# EAGLE design shiftLights (EAGLE 9.6.2)
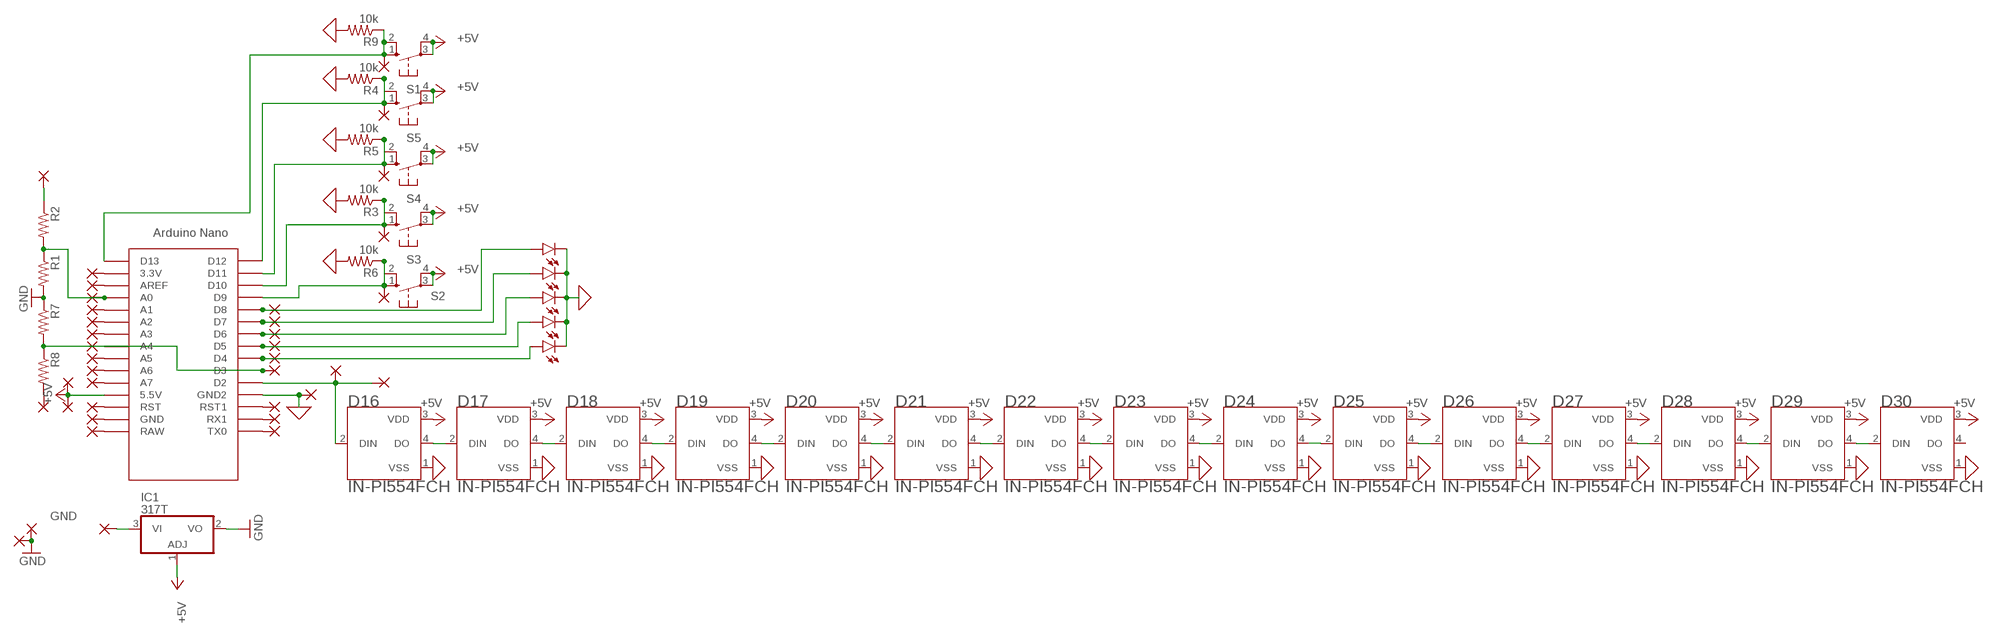
[diagram p0: schematic, sheet 1]

## Parts
5V  1,6/0,9  [1,6/0,9]
+12V  1,6/0,9  [1,6/0,9]
D16  IN-PI554FCH  [LED_IN-PI554FCH]
D17  IN-PI554FCH  [LED_IN-PI554FCH]
D18  IN-PI554FCH  [LED_IN-PI554FCH]
D19  IN-PI554FCH  [LED_IN-PI554FCH]
D20  IN-PI554FCH  [LED_IN-PI554FCH]
D21  IN-PI554FCH  [LED_IN-PI554FCH]
D22  IN-PI554FCH  [LED_IN-PI554FCH]
D23  IN-PI554FCH  [LED_IN-PI554FCH]
D24  IN-PI554FCH  [LED_IN-PI554FCH]
D25  IN-PI554FCH  [LED_IN-PI554FCH]
D26  IN-PI554FCH  [LED_IN-PI554FCH]
D27  IN-PI554FCH  [LED_IN-PI554FCH]
D28  IN-PI554FCH  [LED_IN-PI554FCH]
D29  IN-PI554FCH  [LED_IN-PI554FCH]
D30  IN-PI554FCH  [LED_IN-PI554FCH]
DIM  1,6/0,9  [1,6/0,9]
DIN  1,6/0,9  [1,6/0,9]
GND  1,6/0,9  [1,6/0,9]
GND4  GND  1,6/0,9  [1,6/0,9]
IC1  317T  [TO220H]
LED1  LED5MM  [LED5MM]
LED2  LED5MM  [LED5MM]
LED3  LED5MM  [LED5MM]
LED4  LED5MM  [LED5MM]
LED5  LED5MM  [LED5MM]
PAD1  1,6/0,9  [1,6/0,9]
PAD2  1,6/0,9  [1,6/0,9]
PAD3  1,6/0,9  [1,6/0,9]
PAD4  1,6/0,9  [1,6/0,9]
PAD5  1,6/0,9  [1,6/0,9]
PAD6  1,6/0,9  [1,6/0,9]
PAD7  1,6/0,9  [1,6/0,9]
PAD8  1,6/0,9  [1,6/0,9]
PAD9  1,6/0,9  [1,6/0,9]
PAD10  1,6/0,9  [1,6/0,9]
PAD11  1,6/0,9  [1,6/0,9]
PAD12  1,6/0,9  [1,6/0,9]
PAD13  1,6/0,9  [1,6/0,9]
PAD14  1,6/0,9  [1,6/0,9]
PAD15  1,6/0,9  [1,6/0,9]
PAD16  1,6/0,9  [1,6/0,9]
PAD17  1,6/0,9  [1,6/0,9]
PAD18  1,6/0,9  [1,6/0,9]
PAD19  1,6/0,9  [1,6/0,9]
PAD20  1,6/0,9  [1,6/0,9]
PAD21  1,6/0,9  [1,6/0,9]
PAD22  1,6/0,9  [1,6/0,9]
PAD23  1,6/0,9  [1,6/0,9]
PAD24  1,6/0,9  [1,6/0,9]
PAD25  1,6/0,9  [1,6/0,9]
PAD26  1,6/0,9  [1,6/0,9]
PAD27  1,6/0,9  [1,6/0,9]
PAD28  1,6/0,9  [1,6/0,9]
PAD29  1,6/0,9  [1,6/0,9]
PAD30  1,6/0,9  [1,6/0,9]
R1  R-US_0411/3V  [0411V]
R2  R-US_0411/3V  [0411V]
R3  10k  R-US_0411/3V  [0411V]
R4  10k  R-US_0411/3V  [0411V]
R5  10k  R-US_0411/3V  [0411V]
R6  10k  R-US_0411/3V  [0411V]
R7  R-US_0411/3V  [0411V]
R8  R-US_0411/3V  [0411V]
R9  10k  R-US_0411/3V  [0411V]
RPM  1,6/0,9  [1,6/0,9]
S1  10-XX  [B3F-10XX]
S2  10-XX  [B3F-10XX]
S3  10-XX  [B3F-10XX]
S4  10-XX  [B3F-10XX]
S5  10-XX  [B3F-10XX]
U$1  NANO  [NANO]

## Nets
0: D16.1(VSS) D17.1(VSS) D18.1(VSS) D19.1(VSS) D20.1(VSS) D21.1(VSS) D22.1(VSS) D23.1(VSS) D24.1(VSS) D25.1(VSS) D26.1(VSS) D27.1(VSS) D28.1(VSS) D29.1(VSS) D30.1(VSS) LED1.K(C) LED2.K(C) LED3.K(C) LED4.K(C) LED5.K(C) PAD28.1(P) R3.2 R4.2 R5.2 R6.2 R9.2 U$1.GND1(GND2) ; supply symbol labelled GND
+5V: 5V.1(P) D16.3(VDD) D17.3(VDD) D18.3(VDD) D19.3(VDD) D20.3(VDD) D21.3(VDD) D22.3(VDD) D23.3(VDD) D24.3(VDD) D25.3(VDD) D26.3(VDD) D27.3(VDD) D28.3(VDD) D29.3(VDD) D30.3(VDD) IC1.1(ADJ) PAD23.1(P) S1.3(P) S1.4(P1) S2.3(P) S2.4(P1) S3.3(P) S3.4(P1) S4.3(P) S4.4(P1) S5.3(P) S5.4(P1) U$1.5V(5.5V)
GND: GND4.1(P) GND.1(P) IC1.2(VO) R1.2 R7.1
N$9: DIM.1(P) R2.1
N$15: R8.2 RPM.1(P)
N$16: D16.4(DO) D17.2(DIN)
N$17: D17.4(DO) D18.2(DIN)
N$18: D16.2(DIN) DIN.1(P) PAD29.1(P) U$1.D2
N$20: PAD30.1(P) R7.2 R8.1 U$1.D3
N$21: PAD1.1(P) U$1.A1
N$22: PAD3.1(P) U$1.AREF
N$23: LED1.A PAD4.1(P) U$1.D8
N$24: PAD5.1(P) U$1.3.3V
N$25: LED3.A PAD6.1(P) U$1.D6
N$26: LED4.A PAD7.1(P) U$1.D5
N$27: LED5.A PAD8.1(P) U$1.D4
N$28: PAD9.1(P) U$1.RST1
N$29: PAD10.1(P) U$1.RX1
N$30: PAD11.1(P) U$1.TX0
N$31: PAD2.1(P) R1.1 R2.2 U$1.A0
N$32: PAD13.1(P) R6.1 S2.1(S) S2.2(S1) U$1.D9
N$33: PAD12.1(P) R3.1 S3.1(S) S3.2(S1) U$1.D10
N$34: PAD15.1(P) R5.1 S4.1(S) S4.2(S1) U$1.D11
N$35: D18.4(DO) D19.2(DIN)
N$36: PAD17.1(P) U$1.A2
N$37: PAD18.1(P) U$1.A3
N$38: PAD19.1(P) U$1.A4
N$39: PAD20.1(P) U$1.A5
N$40: PAD21.1(P) U$1.A6
N$41: PAD22.1(P) U$1.A7
N$42: +12V.1(P) IC1.3(VI)
N$43: PAD24.1(P) U$1.RST
N$44: PAD25.1(P) U$1.GND
N$45: PAD26.1(P) U$1.RAW
N$46: LED2.A PAD27.1(P) U$1.D7
N$47: D19.4(DO) D20.2(DIN)
N$48: PAD16.1(P) R4.1 S5.1(S) S5.2(S1) U$1.D12
N$49: D20.4(DO) D21.2(DIN)
N$50: D21.4(DO) D22.2(DIN)
N$51: D22.4(DO) D23.2(DIN)
N$52: PAD14.1(P) R9.1 S1.1(S) S1.2(S1) U$1.D13
N$53: D23.4(DO) D24.2(DIN)
N$54: D24.4(DO) D25.2(DIN)
N$55: D25.4(DO) D26.2(DIN)
N$56: D26.4(DO) D27.2(DIN)
N$57: D27.4(DO) D28.2(DIN)
N$58: D28.4(DO) D29.2(DIN)
N$59: D29.4(DO) D30.2(DIN)
Unconnected: D30.4(DO) U$1.ICSP1 U$1.ICSP2 U$1.ICSP3 U$1.ICSP4 U$1.ICSP5 U$1.ICSP6

## Library data of the parts
5V +12V DIM DIN GND GND4 PAD1-PAD30 RPM = wirepad:1,6/0,9: THROUGH-HOLE PAD
D16-D30 = IN-PI554FCH:IN-PI554FCH: 5050RGB with integrated IC built in 4 PIN Viewing angle: 120 degrees Check availability <https://pricing.snapeda.com/parts/IN-PI554FCH/Inolux/view-part?ref=eda>; AVAILABILITY: In Stock; DESCRIPTION: Addressable Lighting IN-PI554FCH 1 LED Discrete PWM Red, Green, Blue (RGB) 5.00mm L x 5.00mm W; MF: Inolux; MP: IN-PI554FCH; PACKAGE: Inolux; PRICE: None; PURCHASE-URL: https://pricing.snapeda.com/search/part/IN-PI554FCH/?ref=eda
IC1 = linear:*317: Positive VOLTAGE REGULATOR
LED1-LED5 = led:LED: LED OSRAM: - CHIPLED LG R971, LG N971, LY N971, LG Q971, LY Q971, LO R971, LY R971 LH N974, LH R974 LS Q976, LO Q976, LY Q976 LO Q996 - Hyper CHIPLED LW Q18S LB Q993, LB Q99A, LB R99A - SideLED LS A670, LO A670, LY A670, LG A670, LP A670 LB A673, LV A673, LT A673, LW A673 LH A674 LY A675 LS A676, LA A676, LO A676, LY A676, LW A676 LS A679, LY A679, LG A679 - Hyper Micro SIDELED® LS Y876, LA Y876, LO Y876, LY Y876 LT Y87S - SmartLED LW L88C, LW L88S LB L89C, LB L89S, LG L890 LS L89K, LO L89K, LY L89K LS L896, LA L896, LO L896, LY L896 - TOPLED LS T670, LO T670, LY T670, LG T670, LP T670 LSG T670, LSP T670, LSY T670, LOP T670, LYG T670 LG T671, LOG T671, LSG T671 LB T673, LV T673, LT T673, LW T673 LH T674 LS T676, LA T676, LO T676, LY T676, LB T676, LH T676, LSB T676, LW T676 LB T67C, LV T67C, LT T67C, LS T67K, LO T67K, LY T67K, LW E67C LS E67B, LA E67B, LO E67B, LY E67B, LB E67C, LV E67C, LT E67C LW T67C LS T679, LY T679, LG T679 LS T770, LO T770, LY T770, LG T770, LP T770 LB T773, LV T773, LT T773, LW T773 LH T774 LS E675, LA E675, LY E675, LS T675 LS T776, LA T776, LO T776, LY T776, LB T776 LHGB T686 LT T68C, LB T68C - Hyper Mini TOPLED® LB M676 - Mini TOPLED Santana® LG M470 LS M47K, LO M47K, LY M47K Source: http://www.osram.convergy.de LUXEON: - LUMILED® LXK2-PW12-R00, LXK2-PW12-S00, LXK2-PW14-U00, LXK2-PW14-V00 LXK2-PM12-R00, LXK2-PM12-S00, LXK2-PM14-U00 LXK2-PE12-Q00, LXK2-PE12-R00, LXK2-PE12-S00, LXK2-PE14-T00, LXK2-PE14-U00 LXK2-PB12-K00, LXK2-PB12-L00, LXK2-PB12-M00, LXK2-PB14-N00, LXK2-PB14-P00, LXK2-PB14-Q00 LXK2-PR12-L00, LXK2-PR12-M00, LXK2-PR14-Q00, LXK2-PR14-R00 LXK2-PD12-Q00, LXK2-PD12-R00, LXK2-PD12-S00 LXK2-PH12-R00, LXK2-PH12-S00 LXK2-PL12-P00, LXK2-PL12-Q00, LXK2-PL12-R00 Source: www.luxeon.com KINGBRIGHT: KA-3528ASYC Source: www.kingbright.com
R1-R9 = rcl:R-US_: RESISTOR, American symbol; SPICEPREFIX: R
S1-S5 = switch-omron:10-XX: OMRON SWITCH; MPN: B3F-1000; OC_FARNELL: 176432; OC_NEWARK: 36M3542
U$1 = Arduino-clone:NANO: Arduino Nano

## Board
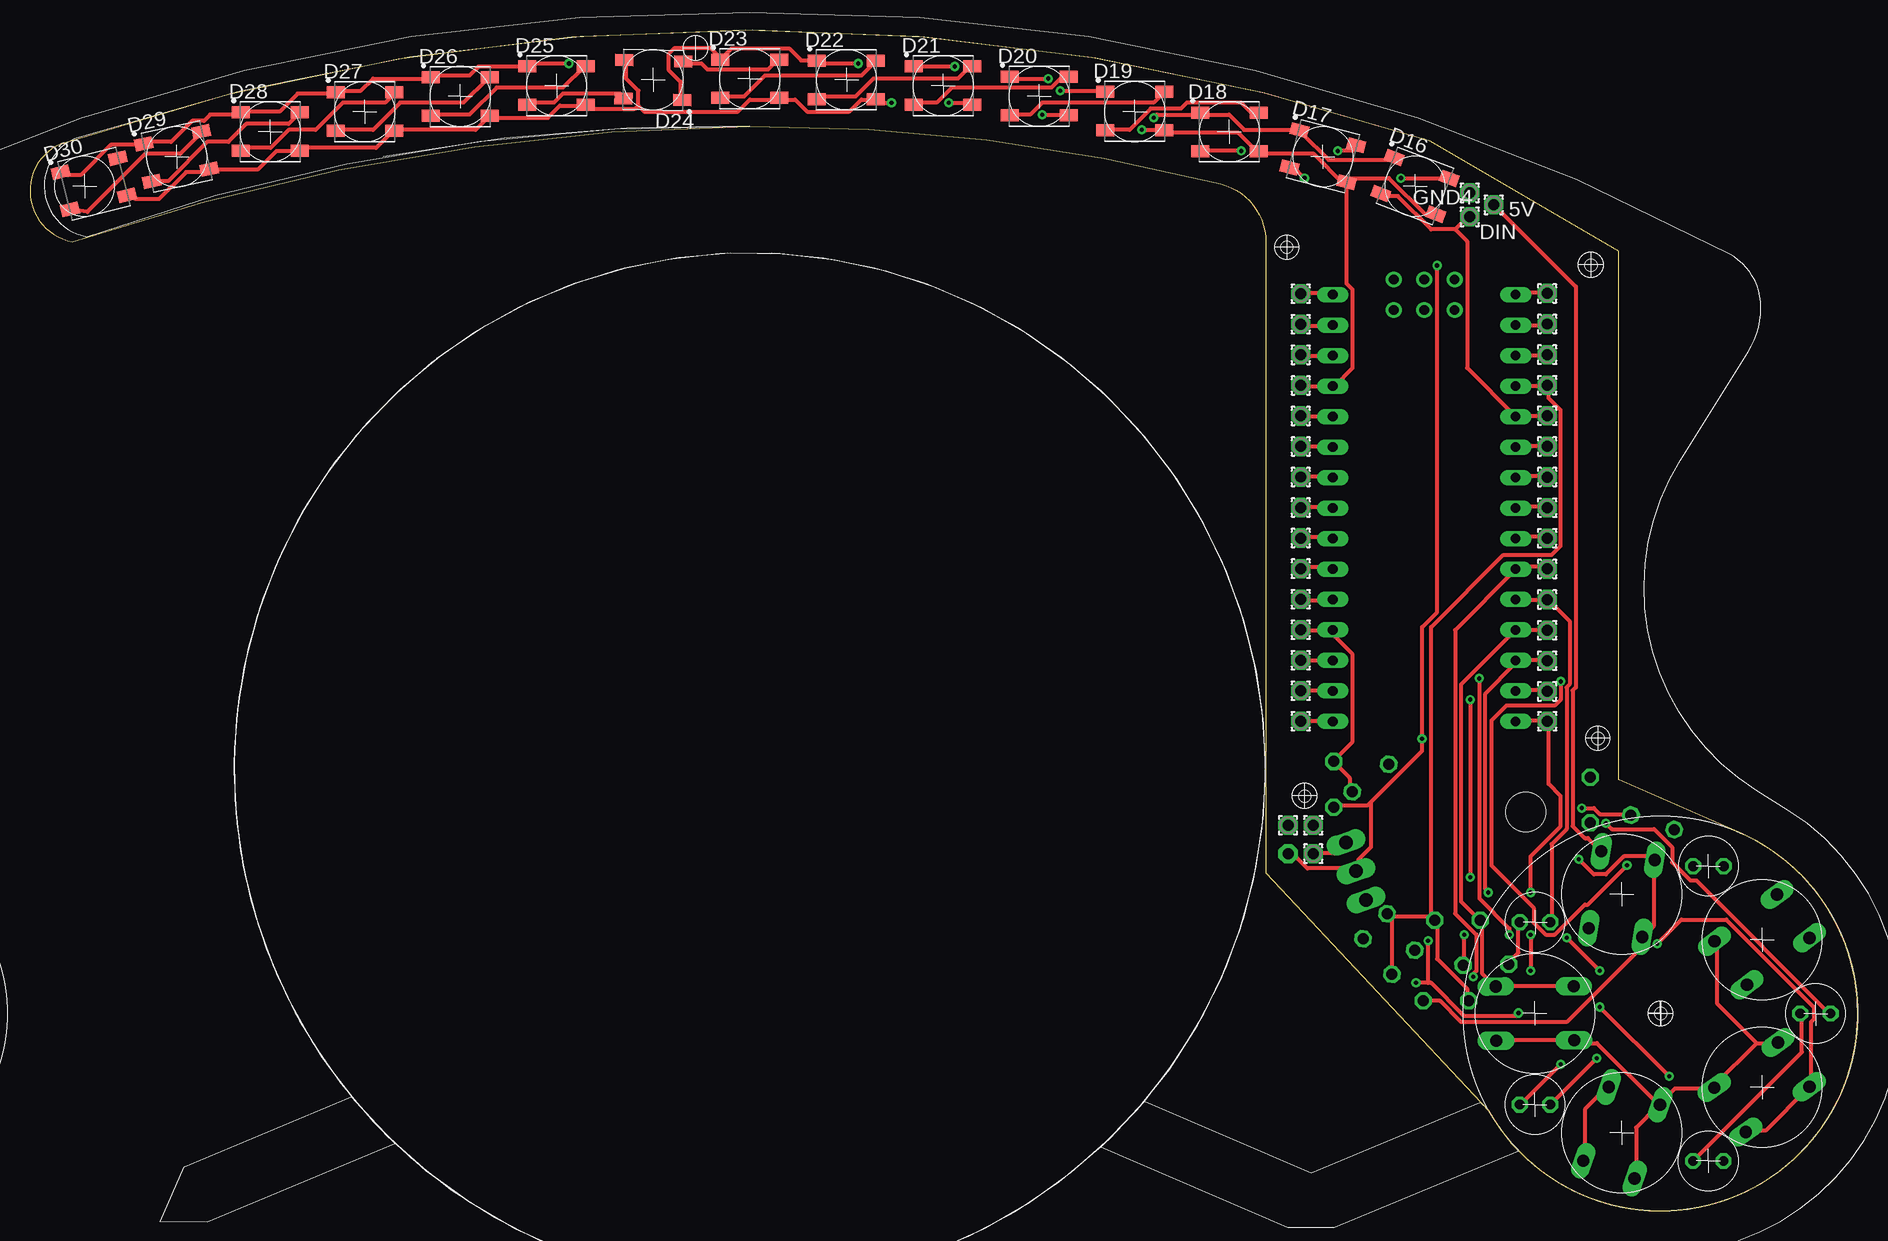
[diagram p1: board, top side]
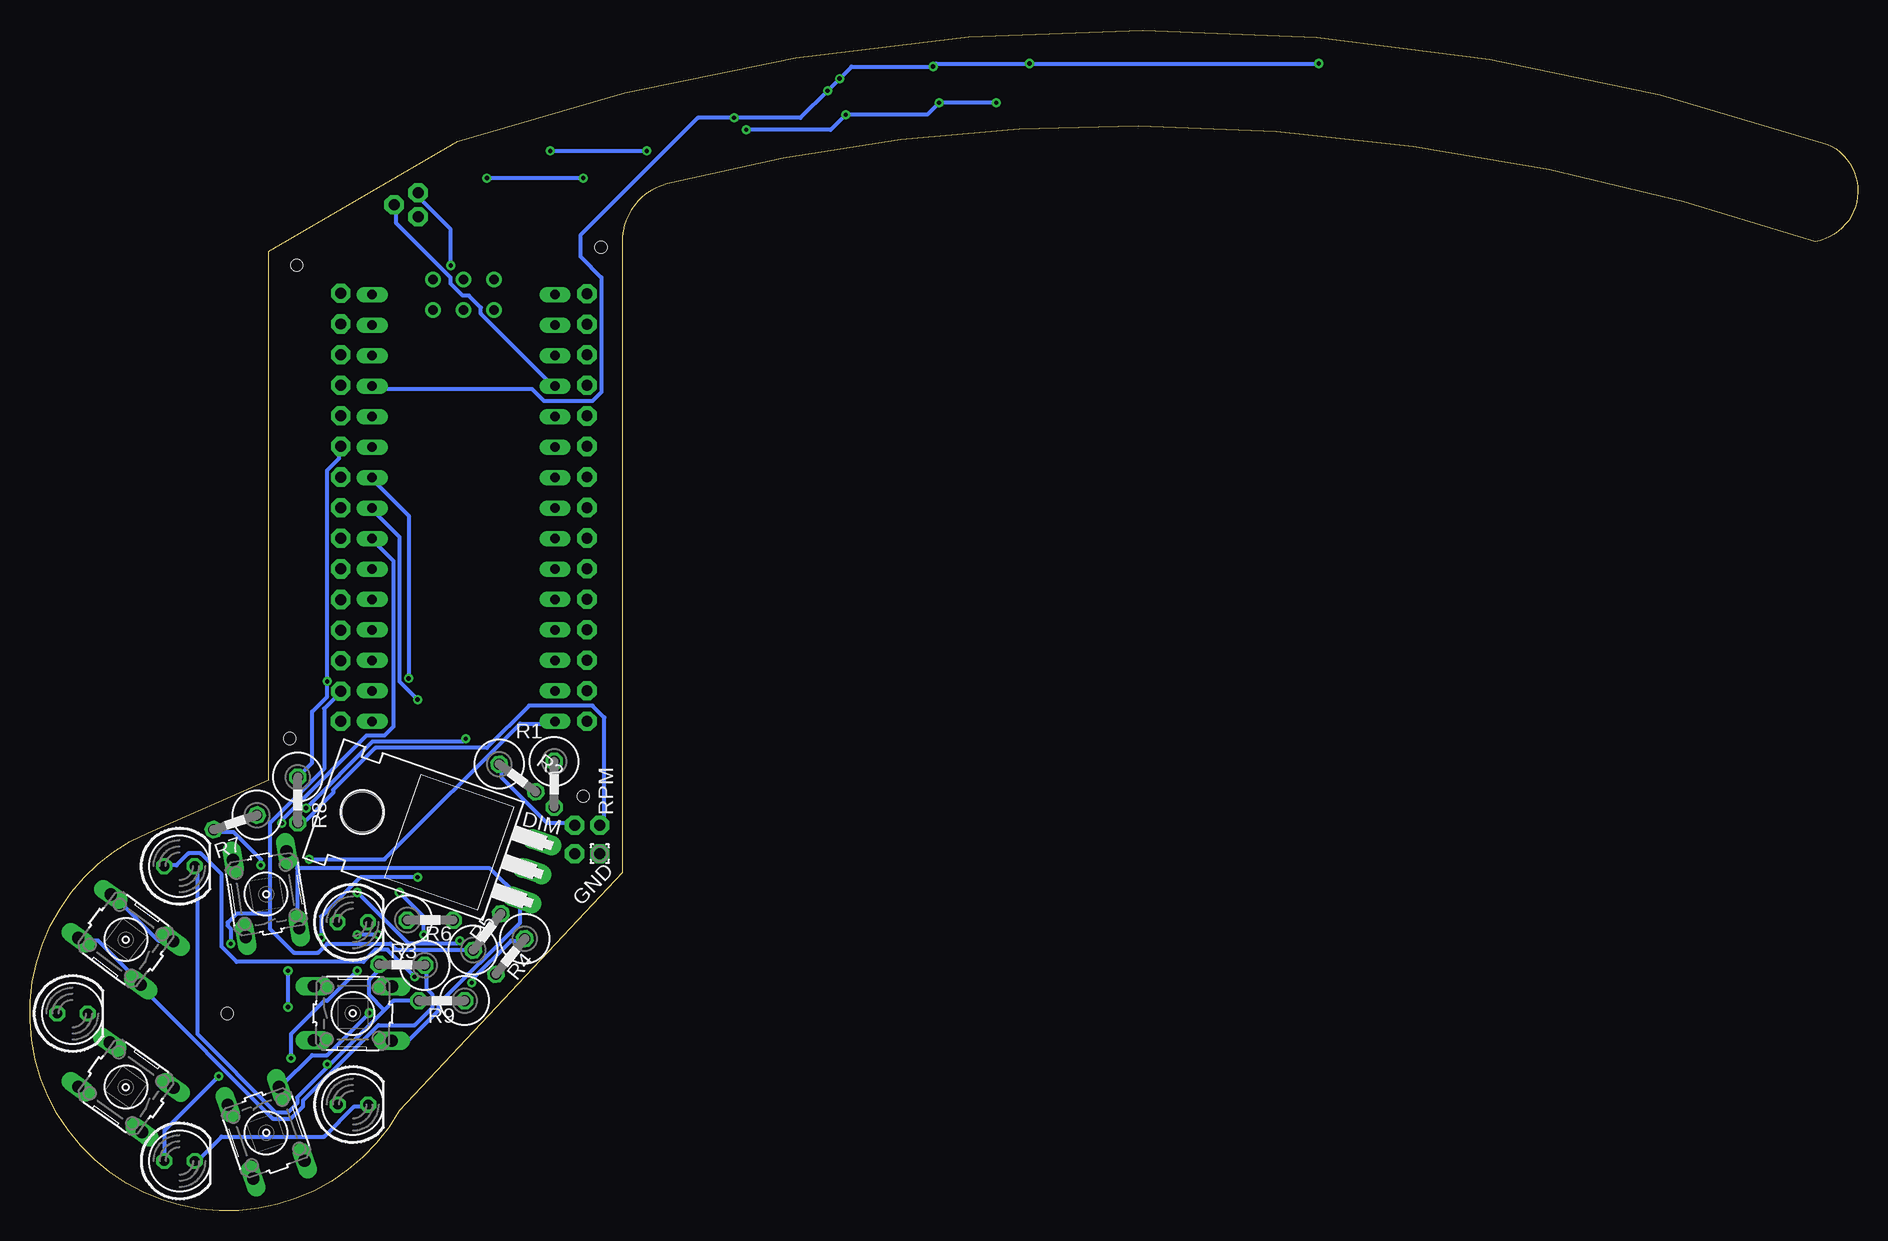
[diagram p2: board, bottom side, seen from below]

Size 152.32 x 98.4 mm. Coordinates in mm from the lower left corner, seen from the top.
Outline: 59.97,90.4 arc-15 99.22,85.58 arc-76 102.98,80.73 102.98,28.17 121.56,8.32 arc217 142.48,31.52 132.41,35.93 132.41,79.97 116.68,89.12 arc37 2.55,88.9 arc146 3.54,80.77 arc-18 59.97,90.4
Copper layers (1*16): Top 0.035mm / dielectric 1.5mm / Bottom 0.035mm
Design rules "default *": minimum track width 0.35mm, minimum drill 0.35mm, track to track 6mil, track to pad 6mil, pad to pad 6mil, via to via 6mil, smd to smd 6mil, copper to edge 40mil, drill to drill 6mil, minimum pad ring 10mil, minimum via ring 8mil, stop-mask expansion 4mil, vias tented up to drill 0mil, thermal gap 10mil
Holes 1 mm at 104.73,80.31 130.09,78.8 130.67,39.35 106.22,34.56 135.89,16.44

### Footprints (pad centres in the part's own frame; a part is rotated, then mirrored left to right if it is on the bottom)
1,6/0,9 = drill 0.914 pad 1.6 octagon: 1 0,0
LED_IN-PI554FCH = smd 1.5 x 1: 1 -2.45,1.6; 2 -2.45,-1.6; 3 2.45,-1.6; 4 2.45,1.6
TO220H = drill 1.118 long: 1 -2.54,-10.16; 2 0,-10.16; 3 2.54,-10.16 | hole 3.302: 0,4.826
LED5MM = drill 0.813 octagon: A -1.27,0; K 1.27,0
0411V = drill 0.914 octagon: 1 -2.54,0; 2 1.27,0
B3F-10XX = drill 1.016 long: 1 -3.251,2.261; 2 3.251,2.261; 3 -3.251,-2.261; 4 3.251,-2.261
NANO = drill 0.8 long: 3.3V -10.16,24.13; 5V -10.16,-1.27; A0 -10.16,19.05; A1 -10.16,16.51; A2 -10.16,13.97; A3 -10.16,11.43; A4 -10.16,8.89; A5 -10.16,6.35; A6 -10.16,3.81; A7 -10.16,1.27; AREF -10.16,21.59; D2 5.08,1.27; D3 5.08,3.81; D4 5.08,6.35; D5 5.08,8.89; D6 5.08,11.43; D7 5.08,13.97; D8 5.08,16.51; D9 5.08,19.05; D10 5.08,21.59; D11 5.08,24.13; D12 5.08,26.67; D13 -10.16,26.67; GND -10.16,-6.35; GND1 5.08,-1.27; RAW -10.16,-8.89; RST -10.16,-3.81; RST1 5.08,-3.81; RX1 5.08,-6.35; TX0 5.08,-8.89 | drill 0.8: ICSP1 -5.08,-10.16; ICSP2 -5.08,-7.62; ICSP3 -2.54,-10.16; ICSP4 -2.54,-7.62; ICSP5 0,-10.16; ICSP6 0,-7.62

### Placement (x,y rotation side)
5V  121.98,83.83 0 top
+12V  106.94,29.76 0 top
D16  115.42,85.41 339.3 top
D17  107.74,87.87 345.4 top
D18  99.96,89.91 0 top
D19  92.06,91.64 0 top
D20  84.1,92.89 0 top
D21  76.09,93.76 0 top
D22  68.02,94.24 0 top
D23  59.98,94.34 0 top
D24  51.94,94.24 178.7 top
D25  43.88,93.76 0 top
D26  35.85,92.85 0 top
D27  27.91,91.61 0 top
D28  20.02,89.93 0 top
D29  12.22,87.86 12.1 top
D30  5.32,85.59 14 top
DIM  106.94,32.14 0 top
DIN  119.98,82.83 0 top
GND  104.84,29.76 0 bottom
GND4  119.98,84.83 0 top
IC1  120.08,31.64 70.8 bottom
LED1  125.42,24.05 0 bottom
LED2  139.87,28.72 0 bottom
LED3  148.78,16.44 0 bottom
LED4  139.85,4.16 0 bottom
LED5  125.41,8.85 0 bottom
PAD1  105.9,50.97 0 top
PAD2  105.9,48.43 0 top
PAD3  105.9,45.88 0 top
PAD4  126.43,50.94 0 top
PAD5  105.9,43.34 0 top
PAD6  126.43,56.04 0 top
PAD7  126.43,58.59 0 top
PAD8  126.43,61.14 0 top
PAD9  126.43,71.35 0 top
PAD10  126.43,73.9 0 top
PAD11  126.43,76.45 0 top
PAD12  126.43,45.84 0 top
PAD13  126.43,48.39 0 top
PAD14  105.9,40.79 0 top
PAD15  126.43,43.28 0 top
PAD16  126.44,40.79 0 top
PAD17  105.9,53.51 0 top
PAD18  105.9,56.06 0 top
PAD19  105.9,58.6 0 top
PAD20  105.9,61.15 0 top
PAD21  105.9,63.69 0 top
PAD22  105.9,66.24 0 top
PAD23  105.9,68.78 0 top
PAD24  105.9,71.33 0 top
PAD25  105.9,73.87 0 top
PAD26  105.9,76.42 0 top
PAD27  126.43,53.49 0 top
PAD28  126.43,68.8 0 top
PAD29  126.43,66.25 0 top
PAD30  126.43,63.69 0 top
R1  108.64,34.9 270 bottom
R2  111.2,35.68 322.8 bottom
R3  121.96,20.51 178.9 bottom
R4  112.69,20.7 230.9 bottom
R5  113.85,23.75 52.8 bottom
R6  118.33,24.23 0 bottom
R7  135.82,32.16 198.6 bottom
R8  130.01,33.6 270 bottom
R9  118.64,17.51 180 bottom
RPM  104.84,32.14 0 top
S1  132.64,26.4 99.3 bottom
S2  125.41,16.45 359.7 bottom
S3  144.34,22.6 143.2 bottom
S4  144.33,10.3 144.6 bottom
S5  132.64,6.5 289.1 bottom
U$1  118.72,67.45 180 bottom

### Tracks (layer width: path | path; a pad name or v marks a point on that pad's centre or on a via)
0  (via drill 0.35)
  Top 0.35: LED3.K 147.65,16.23 147.65,13.21 138.61,4.17 LED4.K | LED1.K 124.04,24.02 124.04,21.5 123.29,20.75 R3.2 | v127.56,12.21 124.29,8.94 LED5.K | U$1.GND1 124.04,68.73 126.3,68.73 PAD28.1 126.55,68.73 126.55,67.73 127.56,66.72 127.56,55.42 126.8,54.66 122.78,54.66 116.76,48.63 116.76,24.52 | 116.76,24.52 113.49,24.52 | 113.49,24.52 113.24,24.52 R5.2 113.49,24.52 | 116.76,24.52 117.01,24.27 R6.2 | 113.49,24.52 113.49,19.75 R4.2 | 116.76,24.52 R6.2 | R9.2 119.77,17.74 119.77,18.49 117.26,21 117.26,24.02 R6.2 | D30.1 2.78,86.31 4.22,86.31 6.73,88.83 9.24,88.83 D29.1 9.49,89.08 11.75,89.08 13.51,90.84 14.52,90.84 15.02,91.34 17.53,91.34 D28.1 17.78,91.59 20.8,91.59 22.3,93.1 25.32,93.1 D27.1 25.57,93.35 27.58,93.35 28.58,94.35 33.36,94.35 D26.1 33.61,94.6 36.62,94.6 37.38,95.36 41.4,95.36 D25.1 41.65,95.61 v44.91,95.61 | D16.1 113.49,87.57 108.21,87.57 105.95,89.83 D17.1 105.7,90.08 101.18,90.08 99.93,91.34 97.66,91.34 D18.1 97.41,91.34 93.9,91.34 v93.65,91.09 | D24.1 54.21,92.59 54.21,94.1 53.2,95.11 53.2,96.36 53.7,96.86 56.72,96.86 57.47,96.11 D23.1 57.72,96.11 58.48,96.86 63.25,96.86 64.25,95.86 65.51,95.86 D22.1 65.76,95.61 v69.03,95.61 | v85.86,93.35 89.37,93.35 D19.1 | v84.85,94.35 81.84,94.35 D20.1 | v77.07,95.36 73.8,95.36 D21.1
  Bottom 0.35: LED5.K 124.29,8.69 125.3,8.69 127.81,6.18 136.35,6.18 138.36,4.17 LED4.K | 122.78,16.73 122.03,17.49 120.02,17.49 R9.2 | 122.78,16.73 127.31,12.21 | 127.31,12.21 130.07,9.45 130.07,8.94 130.82,8.19 131.83,8.19 138.36,14.72 138.36,28.54 LED2.K | 122.78,16.73 124.04,17.99 124.04,19.24 123.29,20 123.29,20.5 R3.2 | 127.31,12.21 v127.56,12.21 | v44.91,95.61 v69.03,95.61 76.81,95.61 v77.07,95.36 83.85,95.36 v84.85,94.35 v85.86,93.35 88.12,91.09 v93.65,91.09 96.66,91.09 106.46,81.29 106.46,79.53 104.7,77.77 104.7,68.23 105.45,67.47 109.47,67.47 110.48,68.48 123.79,68.48 U$1.GND1
+5V  (via drill 0.35)
  Top 0.35: S5.4 133.84,2.92 133.84,6.93 135.6,8.69 S5.3 | S5.3 135.85,8.94 137.1,10.2 140.12,10.2 S4.3 140.37,10.45 143.89,13.97 | 143.89,13.97 145.64,13.97 S4.4 | 143.89,13.97 140.62,17.23 140.62,22.26 S3.3 | S2.4 122.28,14.22 128.56,14.22 S2.3 128.81,13.97 130.57,13.97 135.6,8.94 S5.3 | D17.3 109.47,85.56 106.96,88.07 102.44,88.07 D18.3 102.19,88.32 100.68,89.83 94.65,89.83 D19.3 94.4,90.08 v92.64,90.08 | D16.3 117.01,83.05 116.25,83.05 113.24,86.06 109.97,86.06 109.72,85.81 D17.3 | PAD23.1 105.95,68.73 108.47,68.73 U$1.5V 108.72,68.73 110.22,70.24 110.22,76.77 109.72,77.27 109.72,85.56 D17.3 | v76.56,92.34 78.32,92.34 D21.3 | v71.79,92.34 70.79,92.34 70.53,92.59 D22.3 70.28,92.59 69.28,92.59 68.27,91.59 64.76,91.59 63.75,92.59 62.5,92.59 D23.3 62.25,92.59 59.98,92.59 58.98,91.59 51.19,91.59 50.69,92.09 | v84.35,91.34 86.36,91.34 D20.3 | D30.3 8.83,84.3 10.75,84.3 13.01,86.57 14.77,86.57 D29.3 15.02,86.82 19.04,86.82 20.55,88.32 22.3,88.32 D28.3 22.56,88.57 28.84,88.57 30.34,90.08 D27.3 30.59,90.08 37.13,90.08 38.13,91.09 D26.3 38.38,91.09 43.15,91.09 44.16,92.09 46.17,92.09 D25.3 46.42,92.09 46.67,91.84 50.44,91.84 50.69,92.09 | 50.69,92.09 50.69,93.35 49.69,94.35 49.69,95.86 D24.3 | S1.4 130.82,30.05 129.82,31.05 129.57,31.05 128.56,32.05 128.56,43.36 128.81,43.61 128.81,77.02 122.03,83.8 5V.1
  Bottom 0.35: S3.3 140.62,22.51 141.62,22.51 145.39,26.28 S3.4 | 130.07,28.54 130.07,29.04 130.82,29.79 S1.4 | 130.07,28.54 130.07,23.77 S1.3 | S2.4 122.03,14.22 120.77,14.22 118.26,16.73 118.26,17.23 111.48,24.02 111.48,25.77 IC1.1 111.48,26.03 113.99,28.54 130.07,28.54 | 5V.1 121.78,83.8 121.78,82.29 117.26,77.77 117.26,77.27 116.25,76.27 115.75,76.27 114.75,75.26 114.75,74.76 108.72,68.73 U$1.5V | v71.79,92.34 v76.56,92.34 77.57,91.34 v84.35,91.34 85.61,90.08 v92.64,90.08
GND  (via drill 0.35)
  Top 0.35: GND.1 104.95,29.54 105.45,29.54 106.46,28.54 110.48,28.54 IC1.2 110.73,28.54 110.73,29.29 111.73,30.3 111.73,34.06 | 120.02,84.81 GND4.1 | v129.32,33.56 130.32,33.56 130.82,33.06 133.33,33.06 R7.1 | 111.73,34.06 111.48,33.81 108.72,33.81 R1.2 | 111.73,34.06 116,38.33 v116,39.34 116,48.63 117.26,49.89 v117.26,78.78
  Bottom 0.35: v129.32,33.56 123.79,39.09 116.25,39.09 v116,39.34 | v117.26,78.78 117.26,81.79 119.77,84.3 119.77,84.81 GND4.1
N$9
  Bottom 0.35: R2.1 112.99,37.08 112.99,36.07 109.22,32.31 106.96,32.31 DIM.1
N$15
  Bottom 0.35: R8.2 129.82,32.56 129.32,32.56 127.05,34.82 127.05,35.07 123.54,38.59 114.24,38.59 110.73,42.1 105.45,42.1 104.45,41.1 104.45,32.56 104.7,32.31 RPM.1
N$16  (via drill 0.35)
  Top 0.35: v114.24,86.06 118.26,86.06 D16.4 | v106.21,86.06 105.2,87.07 D17.2
  Bottom 0.35: v106.21,86.06 v114.24,86.06
N$17  (via drill 0.35)
  Top 0.35: v100.93,88.32 97.66,88.32 D18.2 | v108.97,88.32 110.22,88.32 110.48,88.57 D17.4
  Bottom 0.35: v108.97,88.32 v100.93,88.32
N$18
  Top 0.35: PAD29.1 126.3,66.22 124.04,66.22 U$1.D2 123.79,66.22 119.77,70.24 119.77,80.79 118.77,81.79 | 118.77,81.79 116.76,81.79 113.99,84.56 112.74,84.56 D16.2 | 118.77,81.79 119.77,82.8 DIN.1
N$20  (via drill 0.35)
  Top 0.35: U$1.D3 124.04,63.71 126.3,63.71 PAD30.1 | v133.08,28.79 129.82,25.52 129.57,25.52 127.05,23.01 126.3,23.01 125.3,24.02 125.3,25.27 121.78,28.79 121.78,40.85 123.04,42.1 127.05,42.1 127.56,42.61 v127.56,44.11
  Bottom 0.35: v133.08,28.79 133.08,29.29 135.34,31.55 136.85,31.55 R7.2 | R8.1 129.82,36.33 128.81,37.33 128.81,41.6 127.56,42.86 v127.56,44.11 127.56,61.7 126.55,62.7 126.55,63.45 PAD30.1
N$21
  Top 0.35: U$1.A1 108.47,50.89 105.95,50.89 PAD1.1
N$22
  Top 0.35: U$1.AREF 108.47,45.87 105.95,45.87 PAD3.1
N$23
  Top 0.35: U$1.D8 124.04,50.89 126.3,50.89 PAD4.1 126.55,50.89 128.31,49.14 128.31,43.86 128.06,43.61 128.06,31.8 126.8,30.55 126.8,24.27 LED1.A
N$24
  Top 0.35: U$1.3.3V 108.47,43.36 105.95,43.36 PAD5.1
N$25  (via drill 0.35)
  Top 0.35: U$1.D6 124.04,56.17 126.3,56.17 PAD6.1 | v131.33,32.31 131.83,31.8 135.34,31.8 136.85,30.3 136.85,29.04 138.36,27.53 138.86,27.53 149.91,16.48 LED3.A
  Bottom 0.35: v131.33,32.31 131.33,32.56 124.29,39.59 122.78,39.59 122.03,40.34 122.03,54.16 123.79,55.92 U$1.D6
N$26  (via drill 0.35)
  Top 0.35: U$1.D5 124.04,58.68 126.3,58.68 PAD7.1 | v130.82,16.98 v136.6,11.21 | v128.06,22.76 v130.82,20 | v120.02,42.61 v120.02,27.78
  Bottom 0.35: v136.6,11.21 141.12,6.68 141.12,4.17 LED4.A | v130.82,20 v130.82,16.98 | v128.06,22.76 128.06,24.52 124.79,27.78 v120.02,27.78 | v120.02,42.61 121.53,44.11 121.53,56.17 123.79,58.43 U$1.D5
N$27  (via drill 0.35)
  Top 0.35: U$1.D4 124.04,61.19 126.3,61.19 PAD8.1 | v130.57,12.71 126.8,8.94 LED5.A | v125.05,23.01 v125.05,20 | v123.29,23.01 123.29,23.51 120.77,26.03 v120.77,44.36
  Bottom 0.35: v130.57,12.71 130.57,14.72 127.81,17.49 127.56,17.49 v125.05,20 | v123.29,23.01 v125.05,23.01 | v120.77,44.36 120.77,57.93 123.79,60.94 U$1.D4
N$28
  Top 0.35: U$1.RST1 124.04,71.24 126.3,71.24 PAD9.1
N$29
  Top 0.35: U$1.RX1 124.04,73.75 126.3,73.75 PAD10.1
N$30
  Top 0.35: U$1.TX0 124.04,76.52 126.3,76.52 PAD11.1
N$31
  Top 0.35: PAD2.1 105.95,48.38 108.47,48.38 U$1.A0 108.72,48.38 108.72,47.88 110.22,46.37 110.22,39.09 108.72,37.58 R1.1 108.72,37.33 109.97,36.07 109.97,35.07 R2.2
N$32
  Top 0.35: PAD13.1 126.3,48.38 124.04,48.38 U$1.D9 123.79,48.38 119.27,43.86 119.27,25.77 120.77,24.27 R6.1 121.03,24.02 121.03,19.75 122.03,18.74 S2.2 122.28,18.74 128.56,18.74 S2.1
N$33  (via drill 0.35)
  Top 0.35: PAD12.1 126.3,45.87 124.04,45.87 U$1.D10 123.79,45.62 121.28,43.11 121.28,26.78 v121.53,26.53 | v119.52,23.01 119.52,20.5 R3.1
  Bottom 0.35: R3.1 119.27,20.25 119.27,18.49 118.77,17.99 118.77,16.98 120.27,15.48 123.29,15.48 129.57,9.2 129.57,8.69 130.57,7.69 132.08,7.69 143.13,18.74 S3.1 143.13,18.99 146.65,22.51 148.16,22.51 S3.2 | v121.53,26.53 119.52,24.52 v119.52,23.01
N$34  (via drill 0.35)
  Top 0.35: S4.1 143.13,6.68 144.64,6.68 148.16,10.2 S4.2 148.41,10.45 148.41,15.73 148.66,15.98 148.66,16.98 141.37,24.27 137.61,24.27 v135.6,22.26 | U$1.D11 124.04,43.36 126.3,43.36 PAD15.1
  Bottom 0.35: 132.33,24.77 132.33,32.31 127.81,36.83 127.81,41.85 126.55,43.11 PAD15.1 | 132.33,24.77 132.33,23.51 130.32,21.5 128.31,21.5 127.56,22.26 122.28,22.26 121.78,21.76 115.5,21.76 R5.1 | v135.6,22.26 135.6,23.51 135.85,23.77 135.85,24.02 135.09,24.77 132.33,24.77
N$35
  Top 0.35: D19.2 89.63,90.08 91.64,90.08 93.39,91.84 95.91,91.84 96.41,92.34 100.93,92.34 101.68,91.59 102.19,91.59 D18.4
N$36
  Top 0.35: U$1.A2 108.47,53.66 105.95,53.66 PAD17.1
N$37
  Top 0.35: U$1.A3 108.47,56.17 105.95,56.17 PAD18.1
N$38
  Top 0.35: U$1.A4 108.47,58.68 105.95,58.68 PAD19.1
N$39
  Top 0.35: U$1.A5 108.47,61.19 105.95,61.19 PAD20.1
N$40
  Top 0.35: U$1.A6 108.47,63.71 105.95,63.71 PAD21.1
N$41
  Top 0.35: U$1.A7 108.47,66.22 105.95,66.22 PAD22.1
N$42
  Top 0.35: +12V.1 106.96,29.79 108.72,29.79 109.47,30.55 IC1.3
N$43
  Top 0.35: U$1.RST 108.47,71.24 105.95,71.24 PAD24.1
N$44
  Top 0.35: U$1.GND 108.47,73.75 105.95,73.75 PAD25.1
N$45
  Top 0.35: U$1.RAW 108.47,76.52 105.95,76.52 PAD26.1
N$46  (via drill 0.35)
  Top 0.35: PAD27.1 126.3,53.66 124.04,53.66 U$1.D7 123.79,53.41 118.77,48.38 118.77,24.77 120.52,23.01 120.52,20 120.27,19.75 v120.27,19.49
  Bottom 0.35: v120.27,19.49 122.53,21.76 123.54,21.76 124.54,20.75 135.09,20.75 136.35,22.01 136.35,28.04 138.11,29.79 139.11,29.79 140.12,28.79 141.12,28.79 LED2.A
N$47
  Top 0.35: D20.2 81.84,91.34 83.35,91.34 84.35,92.34 93.65,92.34 94.4,93.1 D19.4
N$48  (via drill 0.35)
  Top 0.35: U$1.D12 124.04,40.85 126.3,40.85 PAD16.1 126.55,40.6 126.55,35.57 127.56,34.57 127.56,32.05 125.05,29.54 v125.05,26.53 | 116.5,18.99 116.76,18.99 119.52,16.23 123.79,16.23 v124.04,16.48 | 116.5,18.99 v115.5,18.99 | S5.2 129.57,4.17 129.57,8.44 131.33,10.2 S5.1 | 116.5,18.99 v116.5,22.51
  Bottom 0.35: v115.5,18.99 115.5,19.24 112.23,22.51 111.23,22.51 R4.1 | v124.04,16.48 127.56,12.96 128.81,12.96 131.33,10.45 S5.1 | v125.05,26.53 120.77,22.26 116.76,22.26 v116.5,22.51
N$49
  Top 0.35: D21.2 73.8,92.34 75.56,92.34 76.81,93.6 85.1,93.6 85.86,94.35 86.36,94.35 D20.4
N$50
  Top 0.35: D22.2 65.76,92.85 68.78,92.85 70.28,94.35 77.32,94.35 78.32,95.36 D21.4
N$51
  Top 0.35: D23.2 57.72,92.85 59.48,92.85 61.24,94.6 69.28,94.6 70.28,95.61 D22.4
N$52  (via drill 0.35)
  Top 0.35: U$1.D13 108.47,40.85 105.95,40.85 PAD14.1 | R9.1 116.25,17.49 117.51,17.49 119.27,15.73 128.06,15.73 134.34,22.01 134.34,22.76 S1.1 134.59,23.01 135.34,23.77 135.34,29.04 S1.2 135.34,29.29 135.09,29.54 132.83,29.54 131.33,28.04 130.32,28.04 v129.06,29.29
  Bottom 0.35: v129.06,29.29 122.78,29.29 111.48,40.6 108.72,40.6 U$1.D13
N$53
  Top 0.35: D24.2 54.46,95.61 55.97,95.61 56.47,95.11 61.49,95.11 62.25,95.86 D23.4
N$54
  Top 0.35: D25.2 41.65,92.34 43.66,92.34 44.41,93.1 49.18,93.1 49.43,92.85 D24.4
N$55
  Top 0.35: D26.2 33.61,91.34 36.62,91.34 38.88,93.6 44.41,93.6 46.17,95.36 D25.4
N$56
  Top 0.35: D27.2 25.57,90.08 28.58,90.08 30.85,92.34 36.12,92.34 38.13,94.35 D26.4
N$57
  Top 0.35: D28.2 17.78,88.57 20.04,88.57 21.55,90.08 23.81,90.08 26.07,92.34 29.59,92.34 30.34,93.1 D27.4
N$58
  Top 0.35: D29.2 10.25,85.81 11.5,85.81 14.77,89.08 16.53,89.08 18.03,90.58 21.55,90.58 22.3,91.34 D28.4
N$59
  Top 0.35: D30.2 4.79,83.24 9.62,88.07 12.51,88.07 14.27,89.83 D29.4